# EAGLE design ProtonOnAStick (EAGLE 7.4.0)
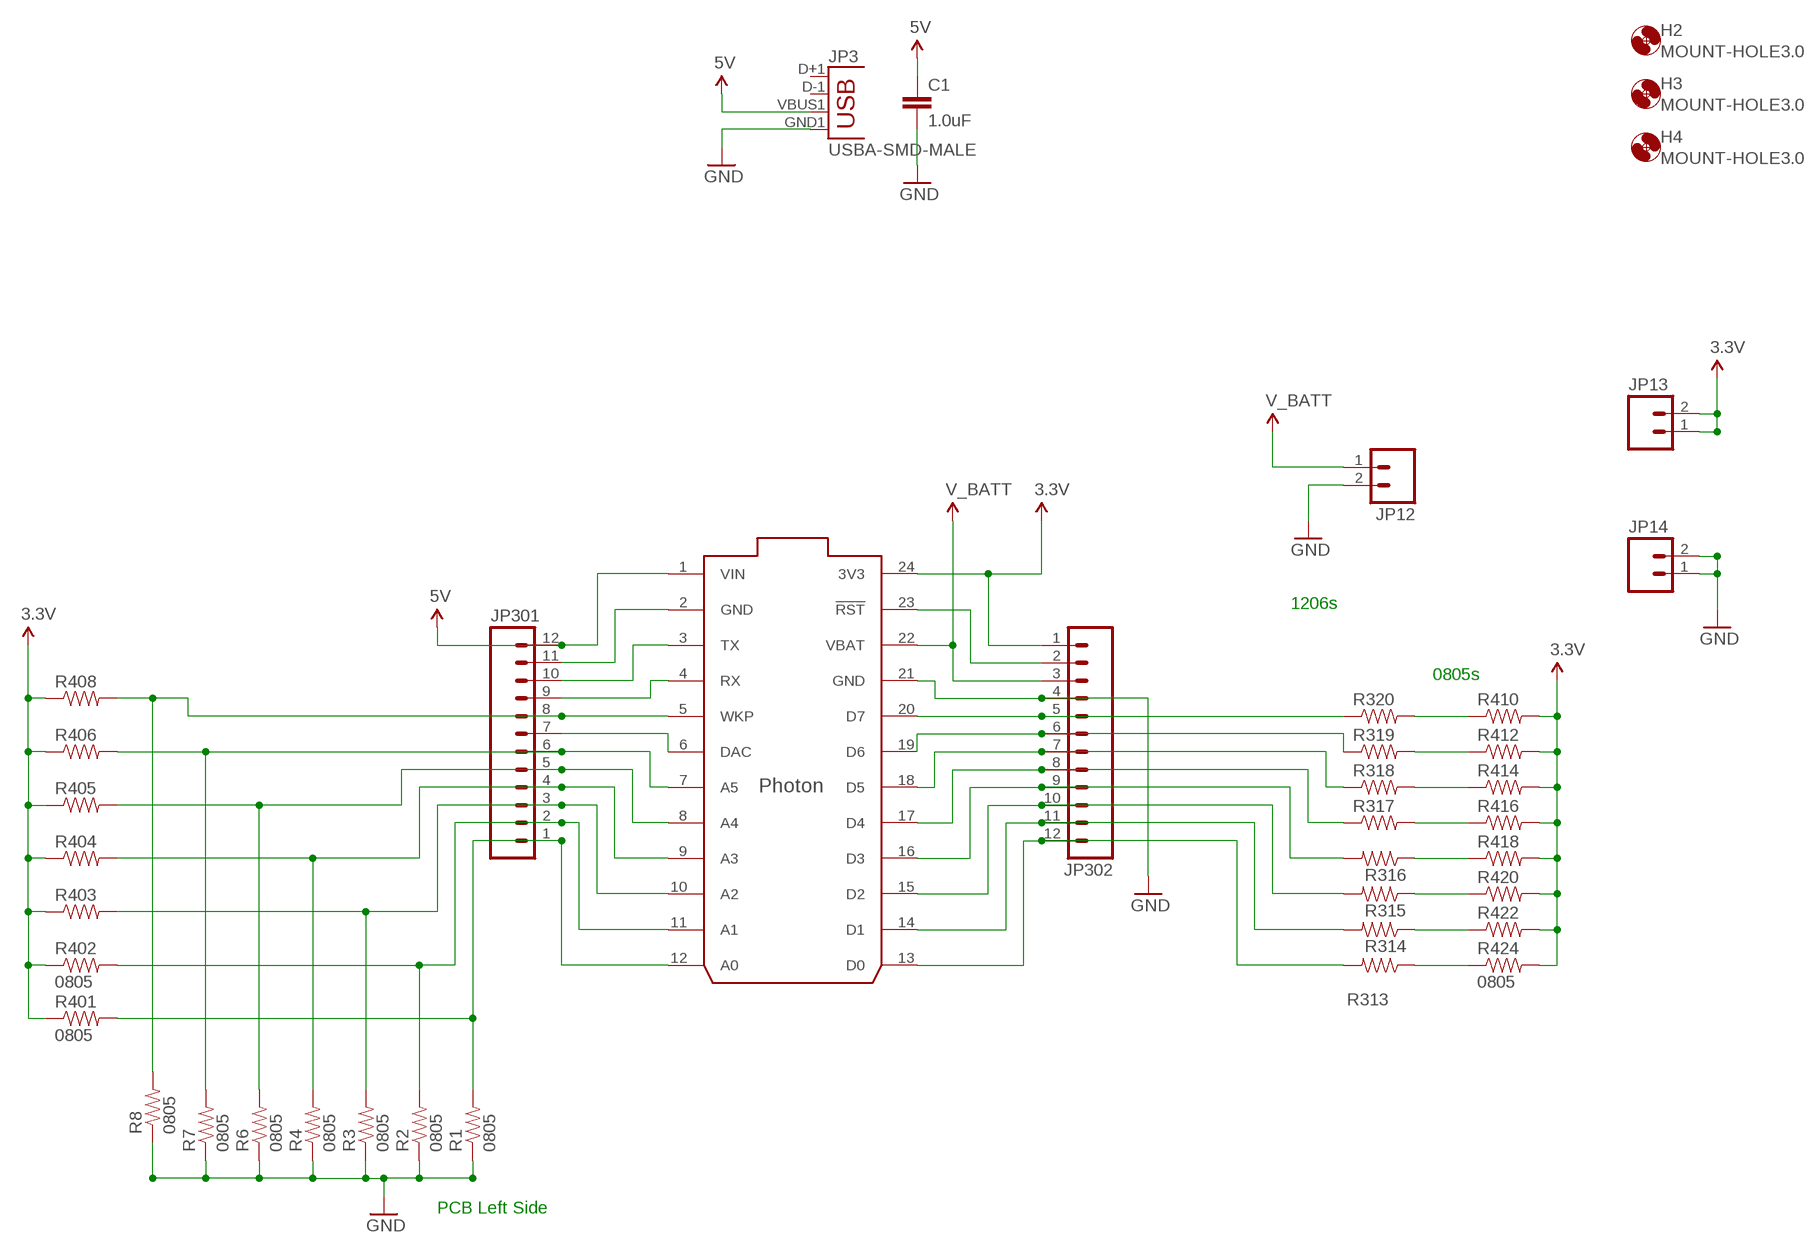
[diagram p0: schematic, sheet 1, part 1 of 2]
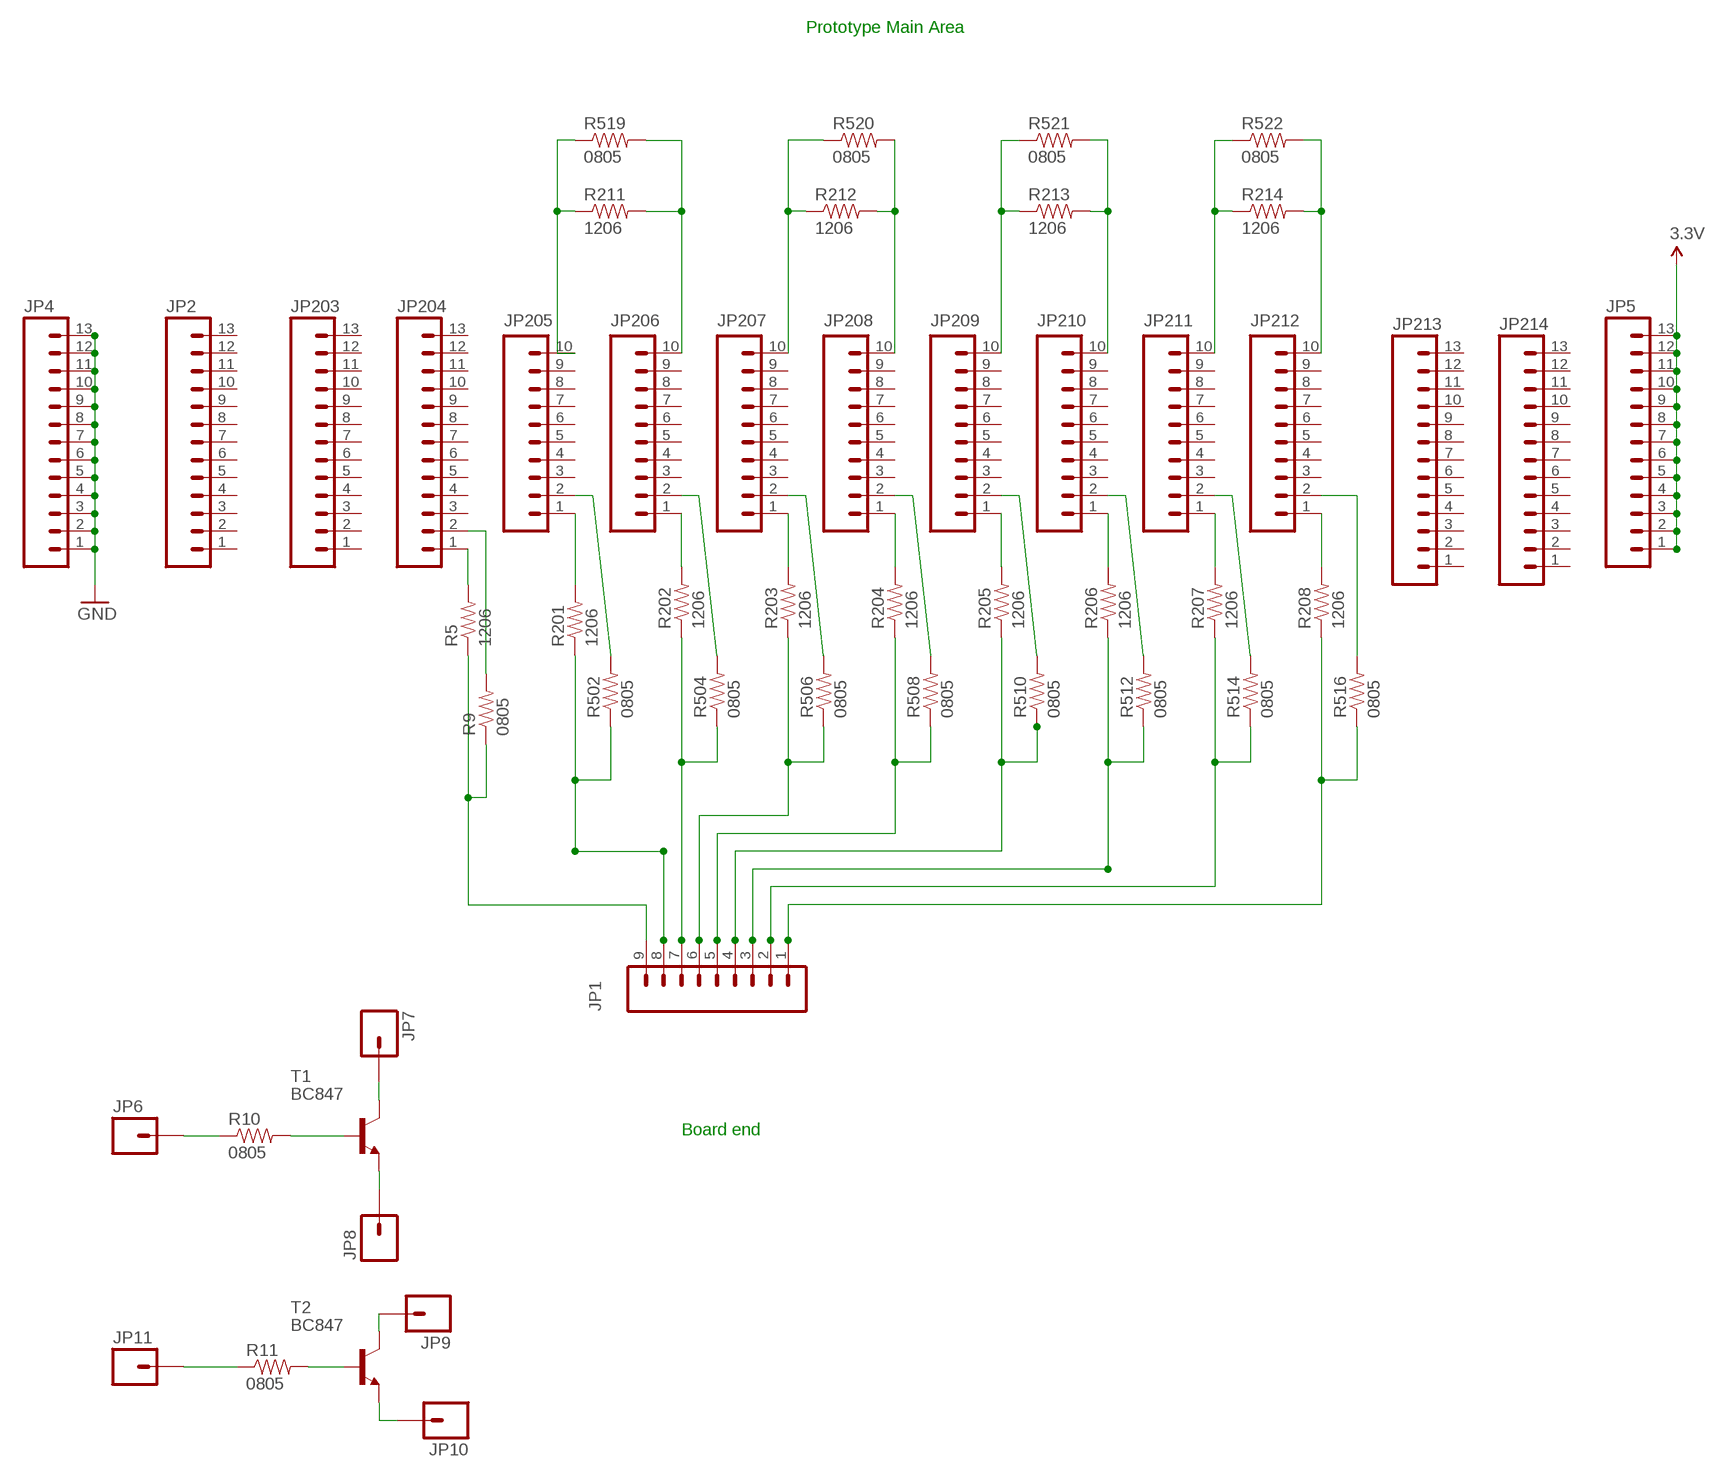
[diagram p1: schematic, sheet 1, part 2 of 2]

## Parts
C1  1.0uF  1.0UF-25V-+80/-20(0805)"  [0805-CAP]
H2  MOUNT-HOLE3.0  [3,0]
H3  MOUNT-HOLE3.0  [3,0]
H4  MOUNT-HOLE3.0  [3,0]
IC1  PHOTON_WITH_HEADERS  [PHOTON]
JP1  M09  [1X09]
JP2  M13  [1X13]
JP3  USBA-SMD-MALE  [USB-A-SMT-MALE]
JP4  M13  [1X13]
JP5  M13  [1X13]
JP6  M01PTH  [1X01]
JP7  M01PTH  [1X01]
JP8  M01PTH  [1X01]
JP9  M01PTH  [1X01]
JP10  M01PTH  [1X01]
JP11  M01PTH  [1X01]
JP12  M02JST-PTH-2  [JST-2-PTH]
JP13  M02PTH  [1X02]
JP14  M02PTH  [1X02]
JP203  M13  [1X13]
JP204  M13  [1X13]
JP205  M10SILK_FEMALE_PTH  [1X10]
JP206  M10SILK_FEMALE_PTH  [1X10]
JP207  M10SILK_FEMALE_PTH  [1X10]
JP208  M10SILK_FEMALE_PTH  [1X10]
JP209  M10SILK_FEMALE_PTH  [1X10]
JP210  M10SILK_FEMALE_PTH  [1X10]
JP211  M10SILK_FEMALE_PTH  [1X10]
JP212  M10SILK_FEMALE_PTH  [1X10]
JP213  M13  [1X13]
JP214  M13  [1X13]
JP301  M12PTH  [1X12]
JP302  M12PTH  [1X12]
R1  0805  RESISTOR0805-RES  [0805]
R2  0805  RESISTOR0805-RES  [0805]
R3  0805  RESISTOR0805-RES  [0805]
R4  0805  RESISTOR0805-RES  [0805]
R5  1206  RESISTOR1206  [1206]
R6  0805  RESISTOR0805-RES  [0805]
R7  0805  RESISTOR0805-RES  [0805]
R8  0805  RESISTOR0805-RES  [0805]
R9  0805  RESISTOR0805-RES  [0805]
R10  0805  RESISTOR0805-RES  [0805]
R11  0805  RESISTOR0805-RES  [0805]
R201  1206  RESISTOR1206  [1206]
R202  1206  RESISTOR1206  [1206]
R203  1206  RESISTOR1206  [1206]
R204  1206  RESISTOR1206  [1206]
R205  1206  RESISTOR1206  [1206]
R206  1206  RESISTOR1206  [1206]
R207  1206  RESISTOR1206  [1206]
R208  1206  RESISTOR1206  [1206]
R211  1206  RESISTOR1206  [1206]
R212  1206  RESISTOR1206  [1206]
R213  1206  RESISTOR1206  [1206]
R214  1206  RESISTOR1206  [1206]
R313  1206  RESISTOR1206  [1206]
R314  1206  RESISTOR1206  [1206]
R315  1206  RESISTOR1206  [1206]
R316  1206  RESISTOR1206  [1206]
R317  1206  RESISTOR1206  [1206]
R318  1206  RESISTOR1206  [1206]
R319  1206  RESISTOR1206  [1206]
R320  1206  RESISTOR1206  [1206]
R401  0805  RESISTOR0805-RES  [0805]
R402  0805  RESISTOR0805-RES  [0805]
R403  0805  RESISTOR0805-RES  [0805]
R404  0805  RESISTOR0805-RES  [0805]
R405  0805  RESISTOR0805-RES  [0805]
R406  0805  RESISTOR0805-RES  [0805]
R408  0805  RESISTOR0805-RES  [0805]
R410  0805  RESISTOR0805-RES  [0805]
R412  0805  RESISTOR0805-RES  [0805]
R414  0805  RESISTOR0805-RES  [0805]
R416  0805  RESISTOR0805-RES  [0805]
R418  0805  RESISTOR0805-RES  [0805]
R420  0805  RESISTOR0805-RES  [0805]
R422  0805  RESISTOR0805-RES  [0805]
R424  0805  RESISTOR0805-RES  [0805]
R502  0805  RESISTOR0805-RES  [0805]
R504  0805  RESISTOR0805-RES  [0805]
R506  0805  RESISTOR0805-RES  [0805]
R508  0805  RESISTOR0805-RES  [0805]
R510  0805  RESISTOR0805-RES  [0805]
R512  0805  RESISTOR0805-RES  [0805]
R514  0805  RESISTOR0805-RES  [0805]
R516  0805  RESISTOR0805-RES  [0805]
R519  0805  RESISTOR0805-RES  [0805]
R520  0805  RESISTOR0805-RES  [0805]
R521  0805  RESISTOR0805-RES  [0805]
R522  0805  RESISTOR0805-RES  [0805]
T1  BC847  [SOT23]
T2  BC847  [SOT23]

## Nets
3.3V: IC1.24(3V3) JP5.1 JP5.2 JP5.3 JP5.4 JP5.5 JP5.6 JP5.7 JP5.8 JP5.9 JP5.10 JP5.11 JP5.12 JP5.13 JP13.1 JP13.2 JP302.1 R401.1 R402.1 R403.1 R404.1 R405.1 R406.1 R408.1 R410.2 R412.2 R414.2 R416.2 R418.2 R420.2 R422.2 R424.2
5V: C1.1 IC1.1(VIN) JP3.VBUS1(VBUS) JP301.12
GND: C1.2 IC1.2(GND) IC1.21(GND) JP3.GND1(GND) JP4.1 JP4.2 JP4.3 JP4.4 JP4.5 JP4.6 JP4.7 JP4.8 JP4.9 JP4.10 JP4.11 JP4.12 JP4.13 JP12.2 JP14.1 JP14.2 JP301.11 JP302.4 R1.1 R2.1 R3.1 R4.1 R6.1 R7.1 R8.1
N$1: JP6.1 R10.1
N$2: JP206.1 R202.2
N$3: JP204.1 R5.2
N$4: IC1.3(TX) JP301.10
N$5: IC1.4(RX) JP301.9
N$6: IC1.5(WKP) JP301.8 R8.2 R408.2
N$7: IC1.6(DAC) JP301.7
N$8: IC1.7(A5) JP301.6 R7.2 R406.2
N$9: IC1.8(A4) JP301.5 R6.2 R405.2
N$10: IC1.9(A3) JP301.4 R4.2 R404.2
N$11: IC1.10(A2) JP301.3 R3.2 R403.2
N$12: IC1.11(A1) JP301.2 R2.2 R402.2
N$13: IC1.12(A0) JP301.1 R1.2 R401.2
N$14: JP1.9 R5.1 R9.1
N$15: R10.2 T1.1(B)
N$16: IC1.18(D5) JP302.7 R318.1
N$17: IC1.17(D4) JP302.8 R317.1
N$18: IC1.16(D3) JP302.9 R316.2
N$19: IC1.15(D2) JP302.10 R315.2
N$20: IC1.14(D1) JP302.11 R314.2
N$21: IC1.13(D0) JP302.12 R313.2
N$22: JP209.1 R205.2
N$23: JP211.2 R514.2
N$24: IC1.23(!RST) JP302.2
N$25: R320.2 R410.1
N$26: JP207.1 R203.2
N$27: JP208.1 R204.2
N$28: JP1.7 R202.1 R504.1
N$29: JP1.6 R203.1 R506.1
N$30: JP1.5 R204.1 R508.1
N$31: JP1.4 R205.1 R510.1
N$32: JP205.1 R201.2
N$33: JP1.8 R201.1 R502.1
N$34: JP210.1 R206.2
N$35: JP211.1 R207.2
N$36: JP1.3 R206.1 R512.1
N$37: JP1.2 R207.1 R514.1
N$38: IC1.20(D7) JP302.5 R320.1
N$39: IC1.19(D6) JP302.6 R319.1
N$40: JP212.2 R516.2
N$41: JP7.1 T1.3(C)
N$43: JP210.2 R512.2
N$44: R313.1 R424.1
N$45: R314.1 R422.1
N$46: R315.1 R420.1
N$47: R316.1 R418.1
N$48: R317.2 R416.1
N$49: R318.2 R414.1
N$50: R319.2 R412.1
N$51: JP209.2 R510.2
N$52: JP206.2 R504.2
N$53: JP205.2 R502.2
N$54: JP207.2 R506.2
N$55: JP8.1 T1.2(E)
N$56: JP212.1 R208.2
N$57: JP1.1 R208.1 R516.1
N$58: JP204.2 R9.2
N$59: JP11.1 R11.1
N$60: R11.2 T2.1(B)
N$61: JP9.1 T2.3(C)
N$62: JP10.1 T2.2(E)
N$66: JP205.10 R211.1 R519.1
N$67: JP206.10 R211.2 R519.2
N$68: JP208.10 R212.2 R520.2
N$69: JP210.10 R213.2 R521.2
N$70: JP212.10 R214.2 R522.2
N$71: JP207.10 R212.1 R520.1
N$72: JP209.10 R213.1 R521.1
N$73: JP211.10 R214.1 R522.1
N$90: JP208.2 R508.2
V_BATT: IC1.22(VBAT) JP12.1 JP302.3
Unconnected: JP2.1 JP2.2 JP2.3 JP2.4 JP2.5 JP2.6 JP2.7 JP2.8 JP2.9 JP2.10 JP2.11 JP2.12 JP2.13 JP3.D+1(D+) JP3.D-1(D-) JP203.1 JP203.2 JP203.3 JP203.4 JP203.5 JP203.6 JP203.7 JP203.8 JP203.9 JP203.10 JP203.11 JP203.12 JP203.13 JP204.3 JP204.4 JP204.5 JP204.6 JP204.7 JP204.8 JP204.9 JP204.10 JP204.11 JP204.12 JP204.13 JP205.3 JP205.4 JP205.5 JP205.6 JP205.7 JP205.8 JP205.9 JP206.3 JP206.4 JP206.5 JP206.6 JP206.7 JP206.8 JP206.9 JP207.3 JP207.4 JP207.5 JP207.6 JP207.7 JP207.8 JP207.9 JP208.3 JP208.4 JP208.5 JP208.6 JP208.7 JP208.8 JP208.9 JP209.3 JP209.4 JP209.5 JP209.6 JP209.7 JP209.8 JP209.9 JP210.3 JP210.4 JP210.5 JP210.6 JP210.7 JP210.8 JP210.9 JP211.3 JP211.4 JP211.5 JP211.6 JP211.7 JP211.8 JP211.9 JP212.3 JP212.4 JP212.5 JP212.6 JP212.7 JP212.8 JP212.9 JP213.1 JP213.2 JP213.3 JP213.4 JP213.5 JP213.6 JP213.7 JP213.8 JP213.9 JP213.10 JP213.11 JP213.12 JP213.13 JP214.1 JP214.2 JP214.3 JP214.4 JP214.5 JP214.6 JP214.7 JP214.8 JP214.9 JP214.10 JP214.11 JP214.12 JP214.13

## Notes on the sheet
- Prototype Main Area
- 1206s
- 0805s
- Board end
- PCB Left Side

## Library data of the parts
C1 = SparkFun-Capacitors:1.0UF-25V-+80/-20(0805): CAP-11625; PROD_ID: CAP-11625
H2-H4 = holes:MOUNT-HOLE: MOUNTING HOLE with drill center marker
IC1 = Spark:PHOTON
JP1 = SparkFun-Connectors:M09: Header 9 Standard 9-pin 0.1" header. Use with straight break away headers (SKU : PRT-00116), right angle break away headers (PRT-00553), swiss pins (PRT-00743), machine pins (PRT-00117), and female headers (PRT-00115).
JP2 JP4 JP5 JP203 JP204 JP213 JP214 = SparkFun-Connectors:M13: 13-pin single row .1" header
JP3 = SparkFun-Connectors:USB: USB Connectors USB-B-PTH is fully proven SKU : PRT-00139/CONN-08278 USB-miniB is fully proven SKU : PRT-00587 USB-A-PCB is untested. USB-A-H is throughly reviewed, but untested. Spark Fun Electronics SKU : PRT-00437 USB-B-SMT is throughly reviewed, but untested. Needs silkscreen touching up. USB-A-S has not been used/tested USB-MB-H has not been used/tested USB-MICROB has been used. CONN-09505
JP6-JP11 = SparkFun-Connectors:M01: Header 1 Standard 1-pin 0.1" header. Use with straight break away headers (SKU : PRT-00116), right angle break away headers (PRT-00553), swiss pins (PRT-00743), machine pins (PRT-00117), and female headers (PRT-00115).
JP12 = SparkFun-Connectors:M02: Standard 2-pin 0.1" header. Use with - straight break away headers ( PRT-00116) - right angle break away headers (PRT-00553) - swiss pins (PRT-00743) - machine pins (PRT-00117) - female headers (PRT-00115) Molex polarized connector foot print use with: PRT-08233 with associated crimp pins and housings. 2.54_SCREWTERM for use with PRT-10571. 3.5mm Screw Terminal footprints for PRT-08084 5mm Screw Terminal footprints for use with PRT-08432; PROD_ID: CONN-09863; SKU: PRT-09914
JP13 JP14 = SparkFun-Connectors:M02: Standard 2-pin 0.1" header. Use with - straight break away headers ( PRT-00116) - right angle break away headers (PRT-00553) - swiss pins (PRT-00743) - machine pins (PRT-00117) - female headers (PRT-00115) Molex polarized connector foot print use with: PRT-08233 with associated crimp pins and housings. 2.54_SCREWTERM for use with PRT-10571. 3.5mm Screw Terminal footprints for PRT-08084 5mm Screw Terminal footprints for use with PRT-08432
JP205-JP212 = SparkFun-Connectors:M10: Header 10 Standard 10-pin 0.1" header. Use with straight break away headers (SKU : PRT-00116), right angle break away headers (PRT-00553), swiss pins (PRT-00743), machine pins (PRT-00117), and female headers (PRT-00115).; PROD_ID: CONN-11563
JP301 JP302 = SparkFun-Connectors:M12: Header 12 Standard 12-pin 0.1" header. Use with straight break away headers (SKU : PRT-00116), right angle break away headers (PRT-00553), swiss pins (PRT-00743), machine pins (PRT-00117), and female headers (PRT-00115).
R1-R11 R201-R208 R211-R214 R313-R320 R401-R406 R408 R410 R412 R414 R416 R418 R420 R422 R424 R502 R504 R506 R508 R510 R512 R514 R516 R519-R522 = SparkFun-Resistors:RESISTOR: Resistor Basic schematic elements and footprints for 0603, 1206, and PTH resistors.
T1 T2 = transistor-neu-to92:BC847: NPN TRANSISTOR

## Board
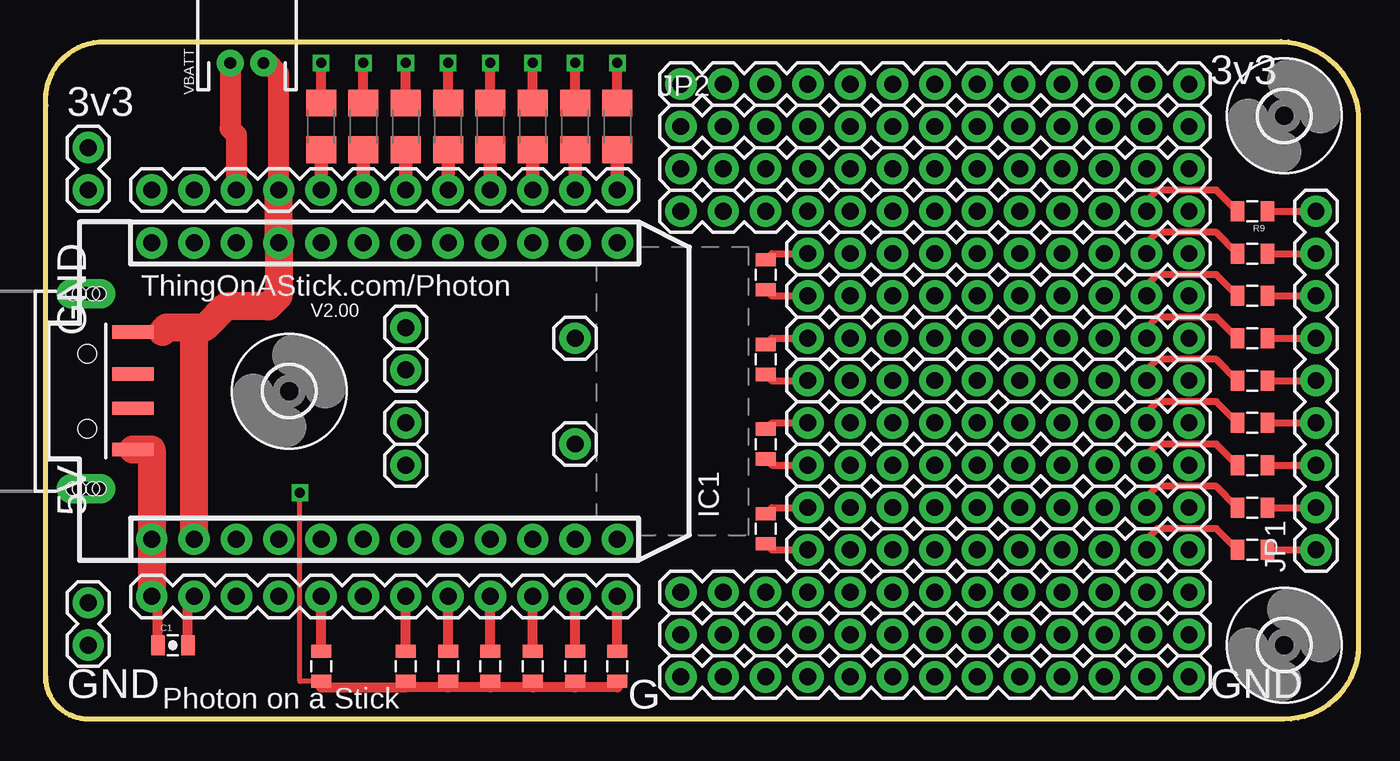
[diagram p2: board, top side]
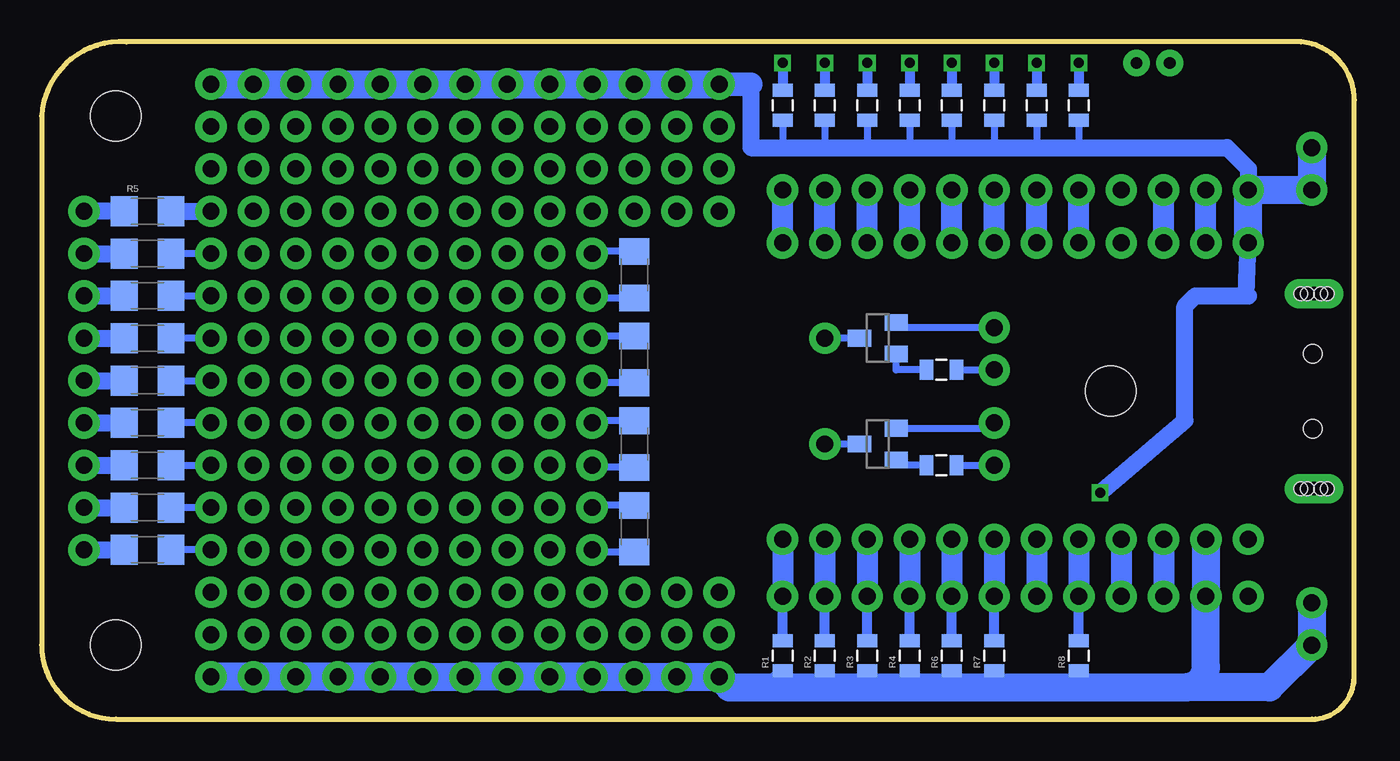
[diagram p3: board, bottom side, seen from below]

Size 78.75 x 40.65 mm. Coordinates in mm from the lower left corner, seen from the top.
Outline: 0.01,2.54 arc90 2.55,0 74.31,0 arc90 78.75,4.45 78.75,36.2 arc90 73.67,40.64 3.19,40.64 arc90 0.01,36.83 0.01,2.16
Copper layers (1*16): Top 0.035mm / dielectric 1.5mm / Bottom 0.035mm
Design rules "default": minimum track width 10mil, minimum drill 24mil, track to track 8mil, track to pad 8mil, pad to pad 8mil, via to via 8mil, smd to smd 8mil, copper to edge 40mil, drill to drill 8mil, minimum pad ring 10mil, minimum via ring 8mil, stop-mask expansion 4mil, vias tented up to drill 0mil, thermal gap 10mil

### Footprints (pad centres in the part's own frame; a part is rotated, then mirrored left to right if it is on the bottom)
0805-CAP = smd 0.8 x 1.2: 1 -0.9,0; 2 0.9,0
3,0 = hole 3: 0,0
PHOTON = drill 1.016 pad 1.88: 1 1.27,32.258; 2 1.27,29.718; 3 1.27,27.178; 4 1.27,24.638; 5 1.27,22.098; 6 1.27,19.558; 7 1.27,17.018; 8 1.27,14.478; 9 1.27,11.938; 10 1.27,9.398; 11 1.27,6.858; 12 1.27,4.318; 13 19.05,4.318; 14 19.05,6.858; 15 19.05,9.398; 16 19.05,11.938; 17 19.05,14.478; 18 19.05,17.018; 19 19.05,19.558; 20 19.05,22.098; 21 19.05,24.638; 22 19.05,27.178; 23 19.05,29.718; 24 19.05,32.258
1X09 = drill 1.016 pad 1.88: 1 0,0; 2 2.54,0; 3 5.08,0; 4 7.62,0; 5 10.16,0; 6 12.7,0; 7 15.24,0; 8 17.78,0; 9 20.32,0
1X13 = drill 1.016 pad 1.88: 1 0,0; 2 2.54,0; 3 5.08,0; 4 7.62,0; 5 10.16,0; 6 12.7,0; 7 15.24,0; 8 17.78,0; 9 20.32,0; 10 22.86,0; 11 25.4,0; 12 27.94,0; 13 30.48,0
USB-A-SMT-MALE = smd 0.8 x 2.5: D+1 1.027,-5.87; D-1 -1.027,-5.87; GND1 3.551,-5.87; VBUS1 -3.5,-5.87 | drill 0.8 pad 1.778 long: P$1 5.85,-3.05; P$3 -5.85,-3.05 | hole 1.1: 2.25,-3.12; -2.25,-3.12 | hole 0.8: -5.85,-3.45; -5.85,-3.85; -5.85,-2.65; -5.85,-2.25; 5.85,-3.45; 5.85,-3.85; 5.85,-2.65; 5.85,-2.25
1X01 = drill 1.016 pad 1.88: 1 0,0
JST-2-PTH = drill 0.7 pad 1.6: 1 -1,0; 2 1,0
1X02 = drill 1.016 pad 1.88: 1 0,0; 2 2.54,0
1X10 = drill 1.016 pad 1.88: 1 0,0; 2 2.54,0; 3 5.08,0; 4 7.62,0; 5 10.16,0; 6 12.7,0; 7 15.24,0; 8 17.78,0; 9 20.32,0; 10 22.86,0
1X12 = drill 1.016 pad 1.88: 1 0,0; 2 2.54,0; 3 5.08,0; 4 7.62,0; 5 10.16,0; 6 12.7,0; 7 15.24,0; 8 17.78,0; 9 20.32,0; 10 22.86,0; 11 25.4,0; 12 27.94,0
0805 = smd 0.8 x 1.2: 1 -0.9,0; 2 0.9,0
1206 = smd 1.6 x 1.8: 1 -1.4,0; 2 1.4,0
SOT23 = smd 1 x 1.4: 1 -0.95,-1.1; 2 0.95,-1.1; 3 0,1.1

### Placement (x,y rotation side)
C1  7.63,4.45 0 top
H2  14.62,19.69 0 top
H3  74.31,36.2 0 top
H4  74.31,4.45 0 top
IC1  38.62,9.53 90 top
JP1  76.21,10.16 90 top
JP2  38.11,35.56 0 top
JP3  -0.62,19.69 90 top
JP4  68.59,2.54 180 top
JP5  68.59,38.1 180 top
JP6  21.6,20.96 0 top
JP7  31.76,22.86 0 top
JP8  21.6,23.5 0 top
JP9  31.76,16.51 0 top
JP10  21.6,17.78 0 top
JP11  21.6,15.24 0 top
JP12  12.08,39.37 0 top
JP13  2.55,31.75 90 top
JP14  2.55,6.98 270 top
JP203  68.59,33.02 180 top
JP204  68.59,30.48 180 top
JP205  68.59,27.94 180 top
JP206  68.59,25.4 180 top
JP207  68.59,22.86 180 top
JP208  68.59,20.32 180 top
JP209  68.59,17.78 180 top
JP210  68.59,15.24 180 top
JP211  68.59,12.7 180 top
JP212  68.59,10.16 180 top
JP213  68.59,7.62 180 top
JP214  68.59,5.08 180 top
JP301  34.3,7.37 180 top
JP302  6.36,31.75 0 top
R1  34.3,3.81 90 bottom
R2  31.76,3.81 90 bottom
R3  29.22,3.81 90 bottom
R4  26.68,3.81 90 bottom
R5  72.4,30.48 0 bottom
R6  24.14,3.81 90 bottom
R7  21.6,3.81 90 bottom
R8  16.52,3.81 90 bottom
R9  72.4,30.48 180 top
R10  24.78,20.96 180 bottom
R11  24.78,15.24 180 bottom
R201  72.4,27.94 0 bottom
R202  72.4,25.4 0 bottom
R203  72.4,22.86 0 bottom
R204  72.4,20.32 0 bottom
R205  72.4,17.78 0 bottom
R206  72.4,15.24 0 bottom
R207  72.4,12.7 0 bottom
R208  72.4,10.16 0 bottom
R211  43.19,26.67 270 bottom
R212  43.19,21.59 270 bottom
R213  43.19,16.51 270 bottom
R214  43.19,11.43 270 bottom
R313  34.3,35.56 270 top
R314  31.76,35.56 270 top
R315  29.22,35.56 270 top
R316  26.68,35.56 270 top
R317  24.14,35.56 90 top
R318  21.6,35.56 90 top
R319  19.06,35.56 90 top
R320  16.52,35.56 90 top
R401  34.3,3.17 90 top
R402  31.76,3.17 90 top
R403  29.22,3.17 90 top
R404  26.68,3.17 90 top
R405  24.14,3.17 90 top
R406  21.6,3.17 90 top
R408  16.52,3.17 90 top
R410  16.52,36.83 270 bottom
R412  19.06,36.83 270 bottom
R414  21.6,36.83 270 bottom
R416  24.14,36.83 270 bottom
R418  26.68,36.83 270 bottom
R420  29.22,36.83 270 bottom
R422  31.76,36.83 270 bottom
R424  34.3,36.83 270 bottom
R502  72.4,27.94 180 top
R504  72.4,25.4 180 top
R506  72.4,22.86 180 top
R508  72.4,20.32 180 top
R510  72.4,17.78 180 top
R512  72.4,15.24 180 top
R514  72.4,12.7 180 top
R516  72.4,10.16 180 top
R519  43.19,26.67 270 top
R520  43.19,21.59 270 top
R521  43.19,16.51 270 top
R522  43.19,11.43 270 top
T1  28.59,22.86 90 bottom
T2  28.59,16.51 90 bottom

### Tracks (layer width: path | path; a pad name or v marks a point on that pad's centre or on a via)
3.3V  (via drill 0.6)
  Top 0.305: R408.1 15.25,2.27 v15.25,13.59
  Top 0.61: R408.1 16.52,1.91 21.6,1.91 | 21.6,1.91 R406.1 | R405.1 24.14,1.91 | 24.14,1.91 21.6,1.91 | R404.1 26.68,1.91 | 26.68,1.91 24.14,1.91 | R403.1 29.22,1.91 | 29.22,1.91 26.68,1.91 | R402.1 31.76,1.91 | 31.76,1.91 29.22,1.91 | R401.1 34.3,1.91 31.76,1.91
  Bottom 0.406: R424.2 34.3,34.29 | R422.2 31.76,34.29 | R420.2 29.22,34.29 | R418.2 26.68,34.29 | R416.2 24.14,34.29 | R414.2 21.6,34.29 | R412.2 19.06,34.29 | R410.2 16.52,34.29
  Bottom 1.016: 36.21,38.1 36.21,34.29 34.3,34.29 31.76,34.29 29.22,34.29 26.68,34.29 24.14,34.29 21.6,34.29 19.06,34.29 16.52,34.29 7.63,34.29 6.36,33.02 JP302.1 | v15.25,13.59 10.17,17.91 10.17,24.77 9.54,25.4 6.36,25.4 6.49,25.53 IC1.24
  Bottom 1.422: JP5.13 36.21,38.1
  Bottom 1.676: IC1.24 JP302.1 JP13.1 JP13.2 | JP5.1 JP5.2 JP5.3 JP5.4 JP5.5 JP5.6 JP5.7 JP5.8 JP5.9 JP5.10 JP5.11 JP5.12 JP5.13
5V
  Top 0.61: C1.1 6.73,7 JP301.12
  Top 1.016: IC1.1 6.36,13.33
  Top 1.676: JP3.VBUS1 6.36,16.19 IC1.1 JP301.12
GND
  Top 0.61: C1.2 8.53,7 JP301.11
  Top 0.813: JP3.GND1 7,23.24
  Top 1.016: 13.98,28.45 arc-90 IC1.21
  Top 1.27: JP302.4 13.98,38.73 13.35,39.37 JP12.2
  Top 1.676: IC1.21 JP302.4 | 13.98,28.45 13.98,25.4 13.35,24.77 10.81,24.77 9.54,23.5 8.9,23.5 | 8.9,23.5 7.25,23.5 7,23.24 | IC1.2 8.9,23.5
  Bottom 0.406: R8.1 16.52,1.91 | R7.1 21.6,1.91 | R6.1 24.14,1.91 | R3.1 arc-90 28.22,1.91 26.68,1.91 R4.1 | 29.22,1.91 30.76,1.91 arc90 R2.1 arc90 32.77,1.91 34.3,1.91 | R1.1 arc-90 34.94,2.27 34.94,1.91
  Bottom 0.813: 13.98,28.45 IC1.21
  Bottom 1.676: IC1.2 JP301.11 8.9,3.17 arc90 10.17,1.91 | JP4.4 JP4.5 JP4.6 JP4.7 JP4.8 JP4.9 JP4.10 JP4.11 JP4.12 JP4.13 37.48,1.91 34.94,1.91 34.3,1.91 29.22,1.91 26.68,1.91 24.14,1.91 21.6,1.91 16.52,1.91 10.17,1.91 | 61.61,2.54 JP4.4 | JP4.4 JP4.3 JP4.2 JP4.1 | 10.17,1.91 5.09,1.91 JP14.2 JP14.1
N$1
  Bottom 0.406: R10.1 JP6.1
N$2
  Bottom 0.406: R202.2 JP206.1
N$3
  Bottom 1.016: R5.2 JP204.1
N$4
  Bottom 0.813: JP301.10 11.57,7.62
  Bottom 1.27: IC1.3 JP301.10
N$5
  Bottom 1.27: IC1.4 JP301.9
N$6
  Top 0.61: R408.2 JP301.8
  Bottom 0.61: R8.2 JP301.8
  Bottom 1.27: IC1.5 JP301.8
N$7
  Bottom 1.27: IC1.6 JP301.7
N$8
  Top 0.61: R406.2 JP301.6
  Bottom 0.61: R7.2 JP301.6
  Bottom 1.27: IC1.7 JP301.6
N$9
  Top 0.61: R405.2 JP301.5
  Bottom 0.61: R6.2 JP301.5
  Bottom 0.813: JP301.5 24.27,7.62
  Bottom 1.27: IC1.8 JP301.5
N$10
  Top 0.61: R404.2 JP301.4
  Bottom 0.61: R4.2 JP301.4
  Bottom 1.27: IC1.9 JP301.4
N$11
  Top 0.61: R403.2 JP301.3
  Bottom 0.61: R3.2 JP301.3
  Bottom 0.813: JP301.3 29.35,7.62
  Bottom 1.27: IC1.10 JP301.3
N$12
  Top 0.61: R402.2 JP301.2
  Bottom 0.61: R2.2 JP301.2
  Bottom 1.27: IC1.11 JP301.2
N$13
  Top 0.61: R401.2 JP301.1
  Bottom 0.61: R1.2 JP301.1 34.3,10.67 arc-90 IC1.12
  Bottom 0.813: JP301.1 34.43,7.62
  Bottom 1.27: IC1.12 JP301.1
N$14
  Top 0.406: R9.1 JP1.9
  Bottom 1.016: R5.1 JP1.9
N$15
  Bottom 0.406: R10.2 27.49,20.96 T1.1
N$16
  Top 0.813: R318.1 JP302.7
  Bottom 1.27: IC1.18 JP302.7
N$17
  Top 0.813: R317.1 JP302.8
  Bottom 0.813: JP302.8 24.27,31.75
  Bottom 1.27: IC1.17 JP302.8
N$18
  Top 0.813: R316.2 JP302.9
  Bottom 1.27: IC1.16 JP302.9
N$19
  Top 0.813: R315.2 JP302.10
  Bottom 0.813: JP302.10 29.35,31.75
  Bottom 1.27: IC1.15 JP302.10
N$20
  Top 0.813: R314.2 JP302.11
  Bottom 0.813: JP302.11 31.89,31.75
  Bottom 1.27: IC1.14 JP302.11
N$21
  Top 0.813: R313.2 JP302.12
  Bottom 0.813: JP302.12 34.43,31.75
  Bottom 1.27: IC1.13 JP302.12
N$22
  Bottom 0.406: JP209.1 R205.2
N$23
  Top 0.406: R514.2 70.23,13.97 66.69,13.97 66.05,13.33 JP211.2
N$24
  Bottom 0.813: JP302.2 9.03,31.75
  Bottom 1.27: IC1.23 JP302.2
N$25  (via drill 0.6)
  Top 0.61: R320.2 v16.52,39.37
  Bottom 0.61: v16.52,39.37 R410.1
N$26
  Bottom 0.406: JP207.1 R203.2
N$27
  Bottom 0.406: R204.2 JP208.1
N$28
  Top 0.406: R504.1 JP1.7
  Bottom 1.016: JP1.7 R202.1
N$29
  Top 0.406: R506.1 JP1.6
  Bottom 1.016: JP1.6 R203.1
N$30
  Top 0.406: R508.1 JP1.5
  Bottom 1.016: JP1.5 R204.1
N$31
  Top 0.406: R510.1 JP1.4
  Bottom 1.016: JP1.4 R205.1
N$32
  Bottom 0.406: JP205.1 R201.2
N$33
  Top 0.406: R502.1 JP1.8
  Bottom 1.016: JP1.8 R201.1
N$34
  Bottom 0.406: R206.2 JP210.1
N$35
  Bottom 0.406: JP211.1 R207.2
N$36
  Top 0.406: R512.1 JP1.3
  Bottom 1.016: JP1.3 R206.1
N$37
  Top 0.406: R514.1 JP1.2
  Bottom 1.016: JP1.2 R207.1
N$38
  Top 0.813: R320.1 JP302.5
  Bottom 0.813: JP302.5 16.65,31.75
  Bottom 1.27: IC1.20 JP302.5
N$39
  Top 0.813: R319.1 JP302.6
  Bottom 0.813: JP302.6 19.19,31.75
  Bottom 1.27: IC1.19 JP302.6
N$40
  Top 0.406: R516.2 70.23,11.43 66.69,11.43 66.05,10.79 JP212.2
N$41
  Bottom 0.406: T1.3 JP7.1
N$43
  Top 0.406: R512.2 70.23,16.51 66.69,16.51 66.05,15.88 JP210.2
N$44  (via drill 0.6)
  Top 0.61: R313.1 v34.3,39.37
  Bottom 0.61: v34.3,39.37 R424.1
N$45  (via drill 0.6)
  Top 0.61: R314.1 v31.76,39.37
  Bottom 0.61: v31.76,39.37 R422.1
N$46  (via drill 0.6)
  Top 0.61: R315.1 v29.22,39.37
  Bottom 0.61: v29.22,39.37 R420.1
N$47  (via drill 0.6)
  Top 0.61: R316.1 v26.68,39.37
  Bottom 0.61: v26.68,39.37 R418.1
N$48  (via drill 0.6)
  Top 0.61: R317.2 v24.14,39.37
  Bottom 0.61: v24.14,39.37 R416.1
N$49  (via drill 0.6)
  Top 0.61: R318.2 v21.6,39.37
  Bottom 0.61: v21.6,39.37 R414.1
N$50  (via drill 0.6)
  Top 0.61: R319.2 v19.06,39.37
  Bottom 0.61: v19.06,39.37 R412.1
N$51
  Top 0.406: R510.2 70.23,19.05 66.69,19.05 66.05,18.42 JP209.2
N$52
  Top 0.406: R504.2 70.23,26.67 66.69,26.67 66.05,26.04 JP206.2
N$53
  Top 0.406: R502.2 70.23,29.21 66.69,29.21 66.05,28.58 JP205.2
N$54
  Top 0.406: R506.2 70.23,24.13 66.69,24.13 66.05,23.5 JP207.2
N$55
  Bottom 0.406: JP8.1 26.85,23.5 T1.2
N$56
  Top 0.406: 69.32,9.88 69.07,9.88 68.8,10.16 JP212.1
  Bottom 0.406: JP212.1 R208.2
N$57
  Top 0.406: R516.1 JP1.1
  Bottom 1.016: JP1.1 R208.1
N$58
  Top 0.406: R9.2 70.23,31.75 66.69,31.75 66.05,31.12 JP204.2
N$59
  Bottom 0.406: R11.1 JP11.1
N$60
  Bottom 0.406: R11.2 27.49,15.24 T2.1
N$61
  Bottom 0.406: T2.3 JP9.1
N$62
  Bottom 0.406: T2.2 21.6,17.46 JP10.1
N$66
  Top 0.406: R519.1 43.56,27.94 JP205.10
  Bottom 0.406: R211.1 45.73,28.07 JP205.10
N$67
  Top 0.406: R519.2 43.56,25.4 JP206.10
  Bottom 0.406: R211.2 45.73,25.27 JP206.10
N$68
  Top 0.406: R520.2 43.56,20.32 JP208.10
  Bottom 0.406: R212.2 45.73,20.19 JP208.10
N$69
  Top 0.406: R521.2 43.56,15.24 JP210.10
  Bottom 0.406: R213.2 45.73,15.11 JP210.10
N$70
  Top 0.406: R522.2 43.56,10.16 JP212.10
  Bottom 0.406: R214.2 45.73,10.03 JP212.10
N$71
  Top 0.406: R520.1 43.56,22.86 JP207.10
  Bottom 0.406: R212.1 45.73,22.99 JP207.10
N$72
  Top 0.406: R521.1 43.56,17.78 JP209.10
  Bottom 0.406: R213.1 45.73,17.91 JP209.10
N$73
  Top 0.406: R522.1 43.56,12.7 JP211.10
  Bottom 0.406: R214.1 45.73,12.83 JP211.10
N$90
  Top 0.406: R508.2 70.23,21.59 66.69,21.59 66.05,20.96 JP208.2
V_BATT
  Top 1.27: JP12.1 11.06,39.35 11.06,35.43 11.44,35.05 JP302.3
  Bottom 1.016: 11.57,31.62 JP302.3
  Bottom 1.27: IC1.22 JP302.3

### Text on the board
tPlace: GND | 5V | G
tNames: VBATT | 3v3 | 3v3 | ThingOnAStick.com/Photon | V2.00 | GND | GND | Photon on a Stick